# EAGLE design power (EAGLE 9.3.1)
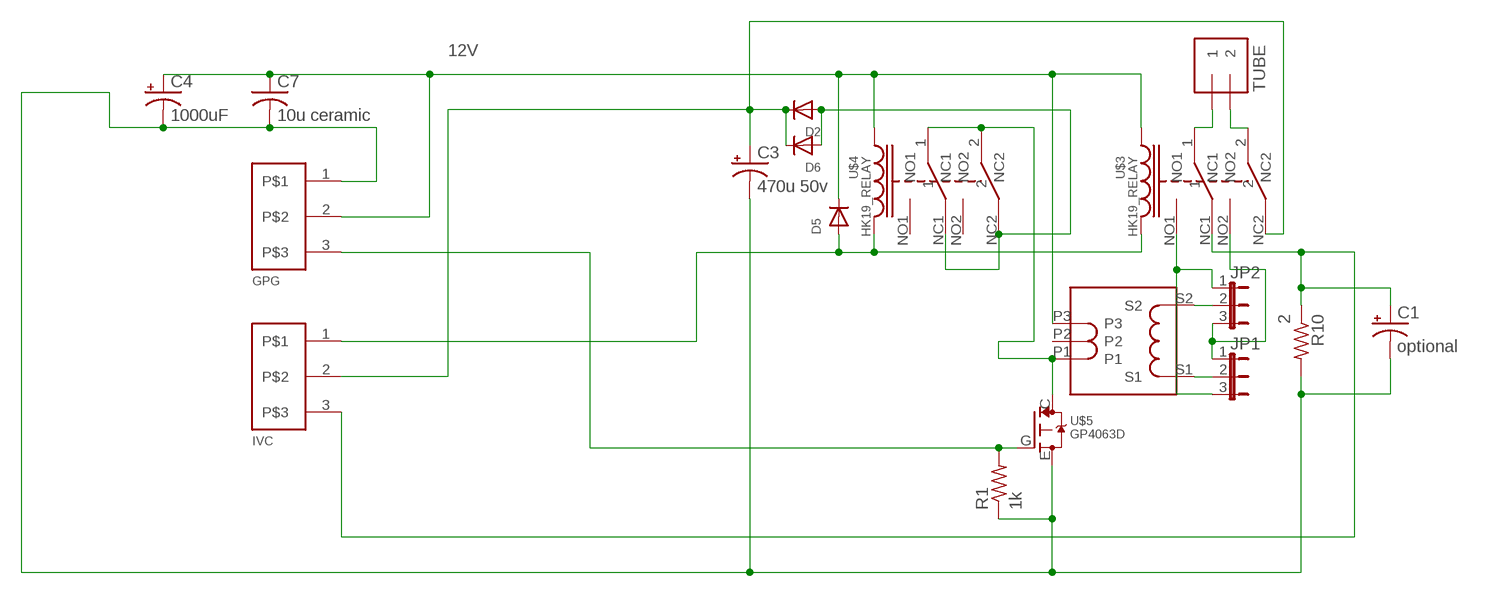
[diagram p0: schematic, sheet 1]

## Parts
C1  optional  CPOL-USE2.5-6  [E2,5-6]
C3  470u 50v  CPOL-USE5-10.5  [E5-10,5]
C4  1000uF  CPOL-USE5-10.5  [E5-10,5]
C7  10u ceramic  C-US050-045X075  [C050-045X075]
D2  DIODEDO-1N4148  [DO-1N4148]
D5  DIODEDO-1N4148  [DO-1N4148]
D6  DIODEDO-1N4148  [DO-1N4148]
GPG  1X3_123  [1X3_123]
IVC  1X3_123  [1X3_123]
JP1  JP2E  [JP2]
JP2  JP2E  [JP2]
R1  1k  R-US_0204/2V  [0204V]
R10  2  R-US_0817/7V  [P0817V]
TUBE  1X2_1221  [1X2_21]
U$2  TRANSFORMER_RAND_1  [TRANSFORMER_RAND_1]
U$3  HK19_RELAY  [HK19RELAY]
U$4  HK19_RELAY  [HK19RELAY]
U$5  GP4063D  [TO247]

## Nets
12V: C4.+ C7.1 D5.C GPG.2 U$2.P3 U$3.C1 U$4.C1
GND: C1.- C3.- C4.- C7.2 GPG.1 R1.1 R10.2 U$5.E
N$3: TUBE.1 U$3.1
N$4: TUBE.2 U$3.2
N$5: JP2.2 U$2.S2
N$6: JP1.2 U$2.S1
N$7: U$2.P1 U$4.1 U$4.2 U$5.C
N$8: GPG.3 R1.2 U$5.G
N$13: JP1.3 JP2.1 U$3.NO1
N$14: JP1.1 JP2.3 U$3.NO2
N$15: D2.A D6.A U$4.NC1 U$4.NC2
N$18: C1.+ IVC.3 R10.1 U$3.NC1
N$19: C3.+ D2.C D6.C IVC.2 U$3.NC2
N$22: D5.A IVC.1 U$3.C2 U$4.C2
Unconnected: U$2.P2 U$4.NO1 U$4.NO2

## Library data of the parts
C1 C3 C4 = adafruit:CPOL-US: POLARIZED CAPACITOR, American symbol
C7 = adafruit:C-US: CAPACITOR, American symbol
D2 D5 D6 = adafruit:DIODE: Diode SMADIODE - SMA Surface Mount Package 20V 1A Schottky Diode Digikey: 641-1014-6-ND DO-1N4148 - Through Hole Small Current Diode SOD-123 20V 1 A (.5mV Vf) Schottky Diode - Digikey: MBRX120TPMSCT-ND SOD-323 10V 570mA (.38mV Vf, 3ns) Schottky Diode - Digikey: ZLLS410CT-ND SOD-523 30V 30mA Schottky Diode (RB751S-40TE61) - Digikey: RB751S-40TE61CT-ND SOT23-R/W - SOT23 Package (R = Solder Paste/Reflow Ovens, W = Hand-Soldering) BAT54Film 40V 300mA - Digikey: 497-7162-1-ND
GPG IVC = aaaacustom:1X3_123
JP1 JP2 = jumper:JP2E: JUMPER
R1 R10 = adafruit:R-US_: RESISTOR, American symbol
TUBE = aaaacustom:1X2_12: 3.5mm Terminal block http://www.ladyada.net/library/pcb/eaglelibrary.html
U$2 = aaaacustom:TRANSFORMER_RAND_1
U$3 U$4 = aaaacustom:HK19_RELAY
U$5 = aaaacustom:GP4063D

## Board
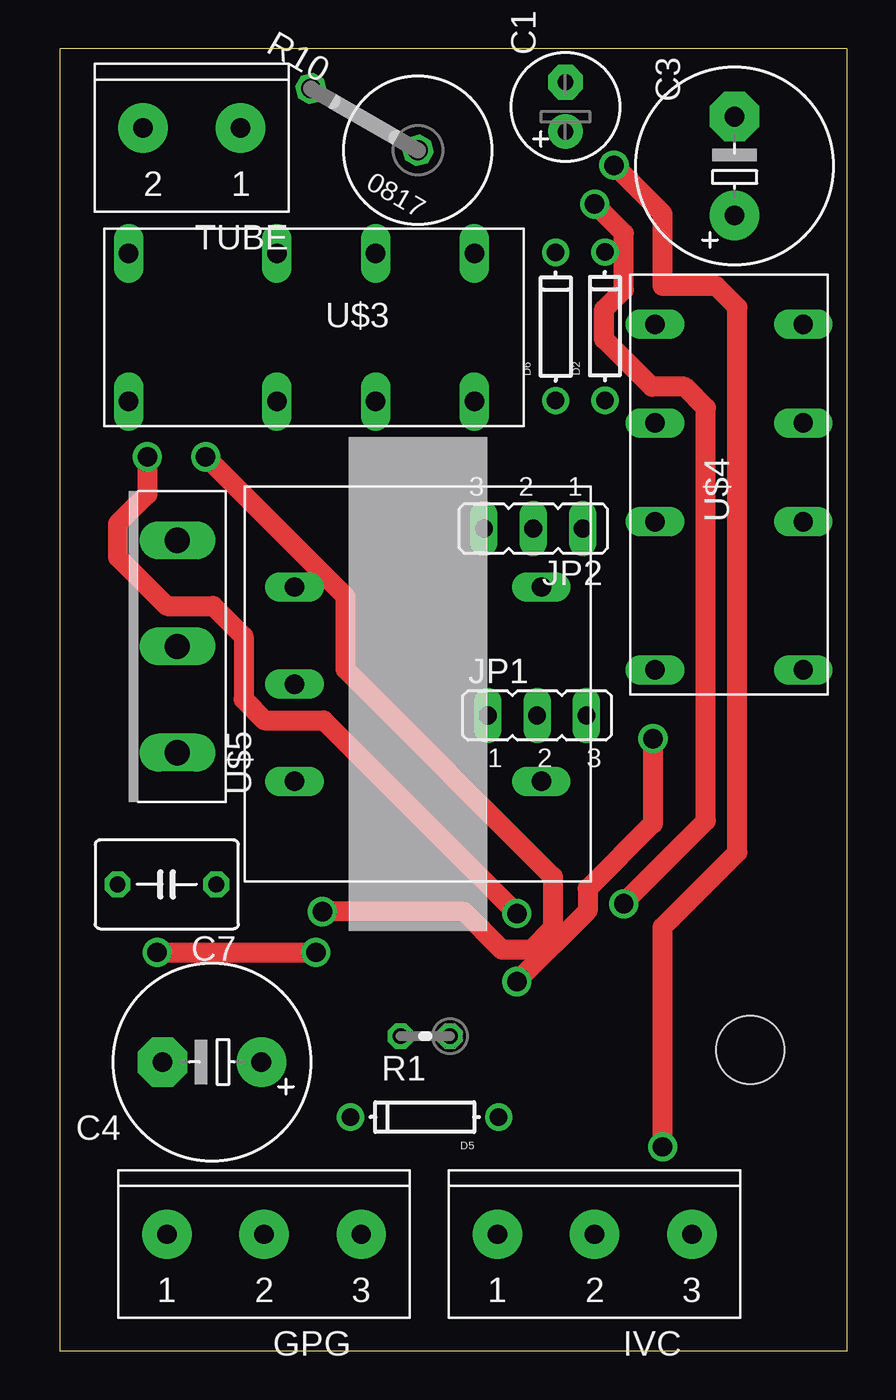
[diagram p1: board, top side]
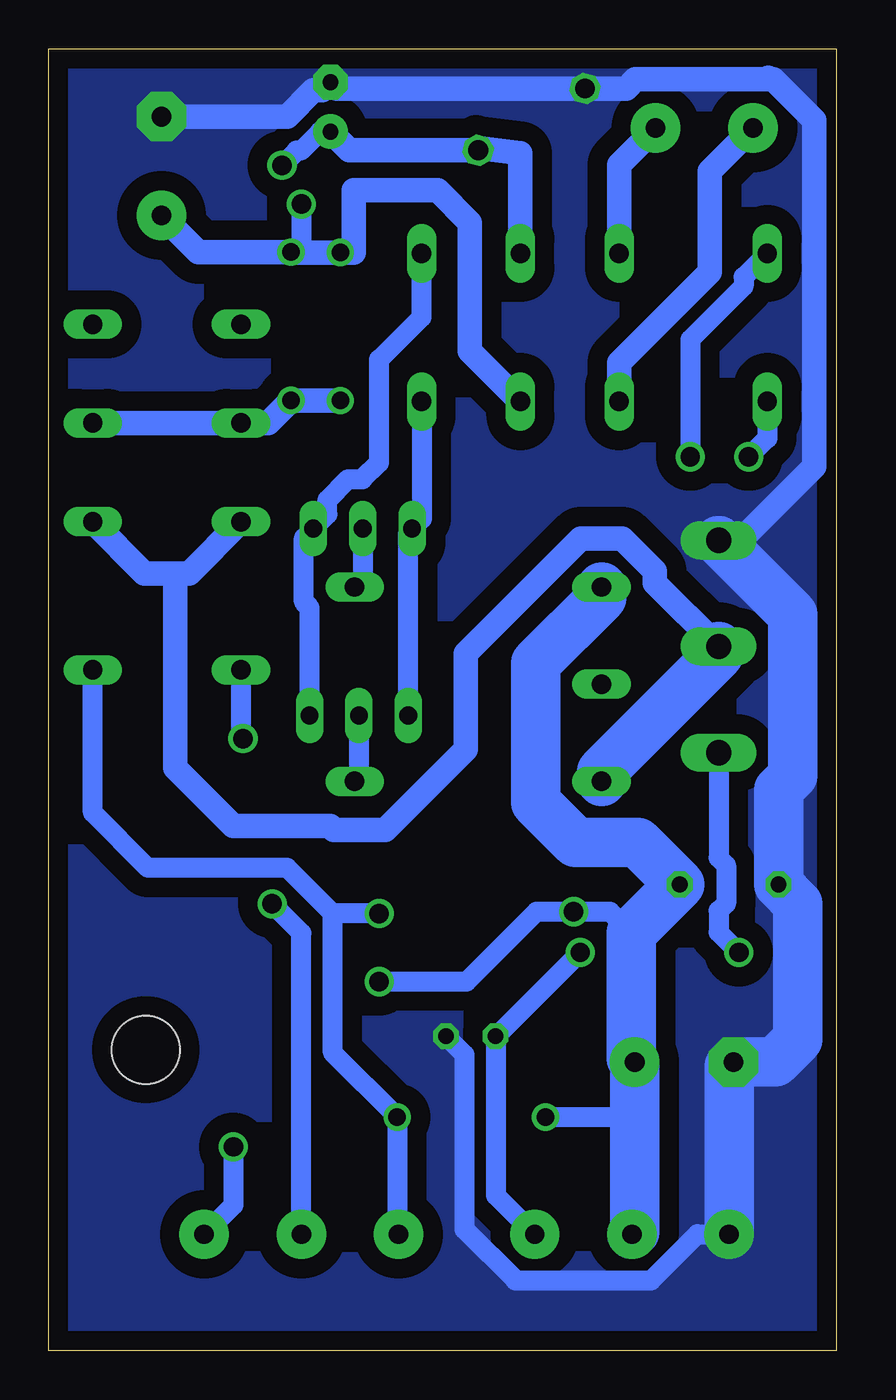
[diagram p2: board, bottom side, seen from below]

Size 40.5 x 67 mm. Coordinates in mm from the lower left corner, seen from the top.
Outline: 0,0 40.5,0 40.5,67 0,67 0,0
Copper layers (1*16): Top 0.035mm / dielectric 1.5mm / Bottom 0.035mm
Design rules "default": minimum track width 1mm, minimum drill 1mm, track to track 0.6mm, track to pad 0.6mm, pad to pad 0.5mm, via to via 0.6mm, smd to smd 6mil, copper to edge 0.5mm, drill to drill 0.5mm, minimum pad ring 10mil, minimum via ring 8mil, stop-mask expansion 4mil, vias tented up to drill 0mil, thermal gap 10mil
Holes 3.5 mm at 35.5,15.5

### Footprints (pad centres in the part's own frame; a part is rotated, then mirrored left to right if it is on the bottom)
E2,5-6 = drill 0.813 pad 1.778: + -1.27,0 | drill 0.813 pad 1.778 octagon: - 1.27,0
E5-10,5 = drill 1.016 pad 2.54: + -2.54,0 | drill 1.016 pad 2.54 octagon: - 2.54,0
C050-045X075 = drill 0.813 octagon: 1 -2.54,0; 2 2.54,0
DO-1N4148 = drill 0.9: A -3.81,0; C 3.81,0
1X3_123 = drill 1 pad 2.54: 1 0,0; 2 5,0; 3 10,0
JP2 = drill 0.914 long: 1 -2.54,0; 2 0,0; 3 2.54,0
0204V = drill 0.813 octagon: 1 -1.27,0; 2 1.27,0
P0817V = drill 1.016 octagon: 1 -5.08,0; 2 1.27,0
1X2_21 = drill 1 pad 2.54: 1 5,0; 2 0,0
TRANSFORMER_RAND_1 = drill 1 long: P1 6.35,5; P2 6.35,0; P3 6.35,-5; S1 -6.35,5; S2 -6.35,-5
HK19RELAY = drill 1 long: 1 0,7.62; 2 7.62,7.62; C1 0,0; C2 7.62,0; NC1 0,12.7; NC2 7.62,12.7; NO1 0,17.78; NO2 7.62,17.78
TO247 = drill 1.3 long: C 0,0; E 5.46,0; G -5.46,0

### Placement (x,y rotation side)
C1  26,64 90 top
C3  34.7,60.96 90 top
C4  7.82,14.86 180 top
C7  5.5,24 180 top
D2  28.03,52.72 90 top
D5  18.76,12.03 180 top
D6  25.5,52.7 90 top
GPG  5.5,6 0 top
IVC  22.5,6 0 top
JP1  24.54,32.69 0 top
JP2  24.35,42.31 180 top
R1  18.79,16.19 180 top
R10  14.01,64.31 150 top
TUBE  4.28,62.91 0 top
U$2  18.41,34.3 180 top
U$3  3.54,56.46 270 top
U$4  30.61,35.04 0 top
U$5  6.04,36.24 90 top

### Tracks (layer width: path | path; a pad name or v marks a point on that pad's centre or on a via)
12V  (via drill 1)
  Top 1.016: v13.5,22.6 20.77,22.6 22.73,20.64 24.27,20.64 25.36,21.73 25.36,24.39 14.68,35.07 14.68,38.82 v7.5,46 | v23.5,19 27.14,22.64 27.14,23.77 30.5,27.13 v30.5,31.5
  Bottom 1.016: D5.C 10.39,12.03 10.36,12 | U$3.C1 4.76,55.24 4.76,54.78 7.5,52.03 v7.5,46 | 10.54,21.5 11.64,22.6 v13.5,22.6 15.4,22.6 19,19 v23.5,19 | U$4.C1 30.61,31.61 v30.5,31.5
  Bottom 2.54: U$2.P3 12.06,38.77 15.44,35.39 15.44,28.21 13.38,26.16 10.2,26.16 C7.1 10.54,21.5 10.54,15.04 C4.+ 10.36,12 10.36,6.14 GPG.2
GND
  Bottom 1.016: R1.1 19.12,15.25 19.12,6.25 16.48,3.62 9.52,3.62 7.14,6 GPG.1
  Bottom 1.27: U$5.E 4.93,41.7 1.14,45.5 1.14,63.31 3.24,65.42 3.42,65.42 3.5,65.5 3.58,65.42 10.32,65.42 10.79,64.94 R10.2 25.68,64.94 C1.- 26.42,64.85 26.88,64.85 28.23,63.5 C3.-
  Bottom 2.54: GPG.1 5.5,14.64 C4.- 3.14,14.86 1.96,16.04 1.96,23 C7.2 2.96,28.86 2.22,29.6 2.22,37.88 U$5.E
  pour Bottom (isolate 1, no thermals): -1,68 42,68 42,-1 -1,-1
N$3
  Bottom 1.27: U$3.1 11.16,61.03 TUBE.1
N$4
  Bottom 1.27: U$3.2 11.16,50.84 6.5,55.5 6.5,60.69 TUBE.2
N$5
  Bottom 1.016: JP2.2 24.35,39.71 U$2.S2
N$6
  Bottom 1.016: JP1.2 24.54,29.52 U$2.S1
N$7
  Bottom 1.27: U$5.C 9.32,39.52 9.32,40.12 11,41.8 13.12,41.8 19.05,35.87 19.05,30.94 23.18,26.81 25.84,26.81 26.03,27 31,27 34,30 34,40 | 34,40 33.27,40 U$4.1 | 34,40 35.57,40 U$4.2
  Bottom 2.54: U$5.C 6.04,35.82 12.06,29.8 U$2.P1
N$8  (via drill 1)
  Top 1.016: v5,20.5 v13.16,20.5
  Bottom 1.016: v5,20.5 6.04,21.54 6.04,22.64 5.66,23.02 5.66,24.98 6.04,25.36 U$5.G | v13.16,20.5 17.5,16.16 | GPG.3 17.5,8 17.5,16.16 | R1.2 17.5,16.16
N$13
  Bottom 1.016: JP1.3 27.08,38.23 27.38,38.53 27.38,41.82 JP2.1 26.17,43.03 26.17,43.77 25.1,44.84 24.36,44.84 23.5,45.7 23.5,51 21.32,53.18 U$3.NO1
N$14
  Bottom 1.016: JP1.1 22,42.12 JP2.3 21.31,42.81 U$3.NO2
N$15
  Bottom 1.27: U$4.NC2 U$4.NC1 29.2,47.74 D2.A 28.01,48.89 D6.A
N$18  (via drill 1)
  Top 1.016: v28.5,61 31,58.5 31,54.78 33.75,54.78 34.84,53.69 34.84,25.65 31,21.81 v31,10.5
  Bottom 1.016: C1.+ 26.54,62.73 27.51,61.76 27.74,61.76 v28.5,61 | v31,10.5 31,7.5 IVC.3 | 18.3,61.88 R10.1
  Bottom 1.27: U$3.NC1 16.24,61.63 18.3,61.88 | R10.1 25.04,61.77 C1.+
N$19  (via drill 1)
  Top 1.016: v27.5,59 29,57.5 29,54.6 27.99,53.59 27.99,52.05 30.44,49.6 32.13,49.6 33.23,48.51 33.23,27.27 29,23.04 v29,23
  Bottom 1.016: IVC.2 27.5,21.5 v29,23 | v27.5,59 27.5,57.02 28.01,56.51
  Bottom 1.27: C3.+ 32.81,56.53 D2.C 28.01,56.51 D6.C 24.81,56.51 24.81,59.7 20.5,59.7 18.83,58.04 18.83,51.43 U$3.NC2
N$22  (via drill 1)
  Top 1.016: v23.5,22.5 13.56,32.44 10.54,32.44 9.44,33.53 9.44,36.76 7.88,38.32 5.5,38.32 2.98,40.84 2.98,42.56 4.5,44.08 v4.5,46
  Bottom 1.016: IVC.1 22.57,6.07 D5.A 25.88,15.34 25.88,22.51 | U$4.C2 38.23,27.69 35.4,24.86 28.23,24.86 25.88,22.51 | U$3.C2 3.54,46.96 v4.5,46 | v23.5,22.5 25.87,22.5 25.88,22.51